# Altium schematic sheet MainPowerSupply.SchDoc: Main power supply
size A4; CheckedBy: Hildo Guillardi Júnior; Author: Joel Guerreiro; Organization: UNICAMP / LCEE; Address1: University of Campinas - Brazil; Address2: Power Conditioning Laboratory; Address3: Licensed by GNU GPL 3.0; Revision: Hildo Guillardi Júnior; ProjectName: Easy Inverter
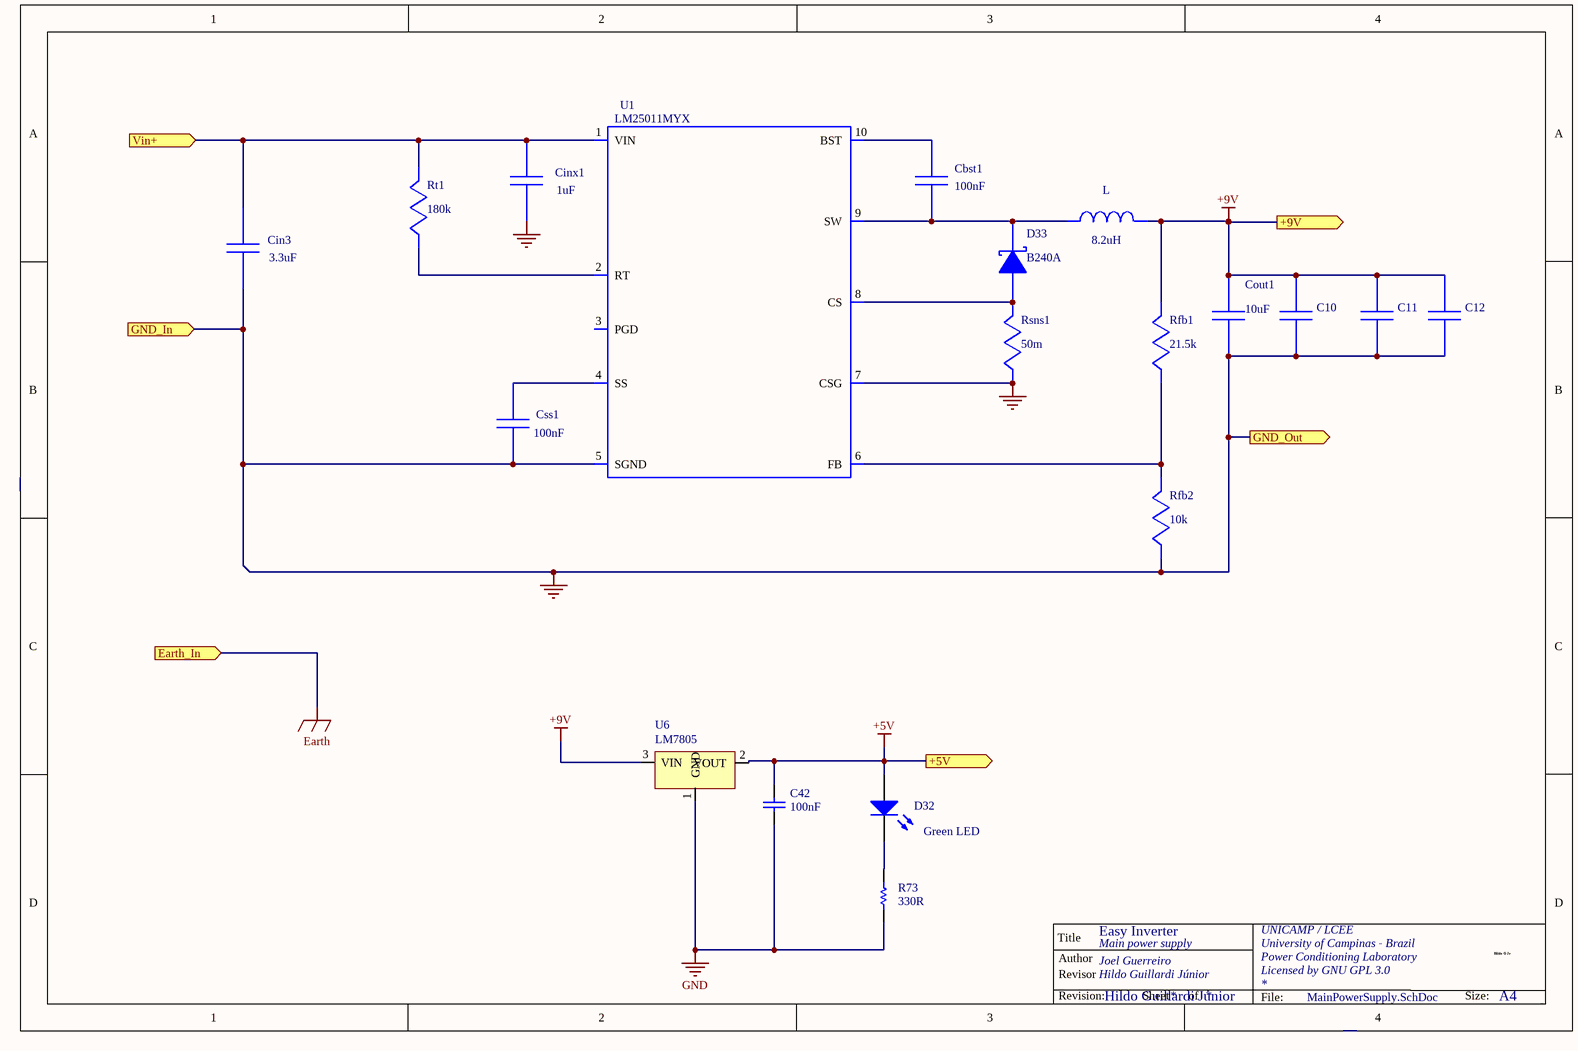
[diagram p0: MainPowerSupply.SchDoc]

## Parts
C10  (no value)  [0805_W]
C11  (no value)  [0805_W]
C12  (no value)  [0805_W]
C42  value 100nF  [0805_W]
Cbst1  value 100nF  [0805_W]
Cin3  value 3.3uF  [1210_W]
Cinx1  value 1uF  [0805_W]
Cout1  value 10uF  [0805_W]
Css1  value 100nF  [0805_W]
D32  value Green LED  [LED_0805]
D33  value B240A  [SOD-123]
L  value 8.2uH  [SRN8040T - Inductor]
R73  value 330R  [0805_W]
Rfb1  value 21.5k  [0805_W]
Rfb2  value 10k  [0805_W]
Rsns1  value 50m  [0805_W]
Rt1  value 180k  [0805_W]
U1  value LM25011MYX  [10MSOP]
U6  value LM7805  [LM7805]

## Ports
+5V (out), +9V (out), Earth_In (in), GND_In (in), GND_Out (out), Vin+ (in)

## Nets
0: C10.2 C11.2 C12.2 Cin3.2 Cinx1.2 Cout1.2 Css1.2 Rfb2.2 Rsns1.2 U1.5(SGND) U1.7(CSG) ; port GND_In, port GND_Out
+5V: C42.1 D32.1(A) U6.2(VOUT) ; port +5V
+9V: C10.1 C11.1 C12.1 Cout1.1 L.2 Rfb1.1 U6.3(VIN) ; port +9V
Earth: port Earth_In
GND: C42.2 R73.1 U6.1(GND)
Vin+: Cin3.1 Cinx1.1 Rt1.1 U1.1(VIN) ; port Vin+
NetCbst1_1: Cbst1.1 U1.10(BST)
NetCbst1_2: Cbst1.2 D33.2(K) L.1 U1.9(SW)
NetCss1_1: Css1.1 U1.4(SS)
NetD32_2: D32.2(K) R73.2
NetD33_1: D33.1(A) Rsns1.1 U1.8(CS)
NetRfb1_2: Rfb1.2 Rfb2.1 U1.6(FB)
NetRt1_2: Rt1.2 U1.2(RT)

Not connected (* = marked no-connect by the designer): U1 3(PGD)

## Notes on the sheet
- Title
- Author
- Revisor
- Hildo G Jr
- Revision:
- Sheet
- of
- File:
- Size:
- A4
- HGJr

## Library data of the parts
C10-C12 = GRM21BR61C106KE15L: GRM21BR61C106KE1; Manufacturer Name: MuRata; PackageReference: GRM21BR61C106KE15L; Manufacturer Part Number: GRM21BR61C106KE15L; Value: Value
C42 = Capacitor_nao_polarizado: Capacitor nao polarizado; pn: 08053C104KAT2A
Cbst1 Css1 = CC0805KRX7R8BB104: CC0805KRX7R8BB10; pn: 08053C104KAT2A
Cin3 = C3225X7S2A335K200AB: C3225X7S2A335K20; Manufacturer Name: TDK; PackageReference: C3225X7S2A335K200AB; Manufacturer Part Number: C3225X7S2A335K200AB; Value: Value
Cinx1 = C1608X5R1H105K080AB: C1608X5R1H105K08; Manufacturer Name: TDK; PackageReference: C1608X5R1H105K080AB; Manufacturer Part Number: C1608X5R1H105K080AB; Value: Value
Cout1 = C0805C106K8PACTU: pn: C0805C106K8PACTU
D32 = LED0: Typical INFRARED GaAs LED; pn: SML-LXR85GC-TR
D33 = B360A-13-F: pn: B360A-13-F
L = SRN8040-8R2Y: pn: SRN8040-8R2Y
R73 = Res_0805: Resistor; pn: RMCF0805JT330R
Rfb1 = CRCW040221K5FKED: Manufacturer Name: Vishay-Dale; PackageReference: CRCW040221K5FKED; Manufacturer Part Number: CRCW040221K5FKED; Value: Value
Rfb2 = CRCW040210K0FKED: Manufacturer Name: Vishay-Dale; PackageReference: CRCW040210K0FKED; Manufacturer Part Number: CRCW040210K0FKED; Value: Value
Rsns1 = CRM0805-FW-R050ELF: CRM0805-FW-R050E; Manufacturer Name: Bourns; PackageReference: CRM0805-FW-R050ELF; Manufacturer Part Number: CRM0805-FW-R050ELF; Value: Value
Rt1 = CRCW0402174KFKED: Manufacturer Name: Vishay-Dale; PackageReference: CRCW0402174KFKED; Manufacturer Part Number: CRCW0402174KFKED; Value: Value
U1 = LM25011MYX/NOPB: pn: LM25011MYX/NOPB
U6 = LM7805: pn: MC7805BDTG